# EAGLE design miniprinter x axis (EAGLE 9.4.2)
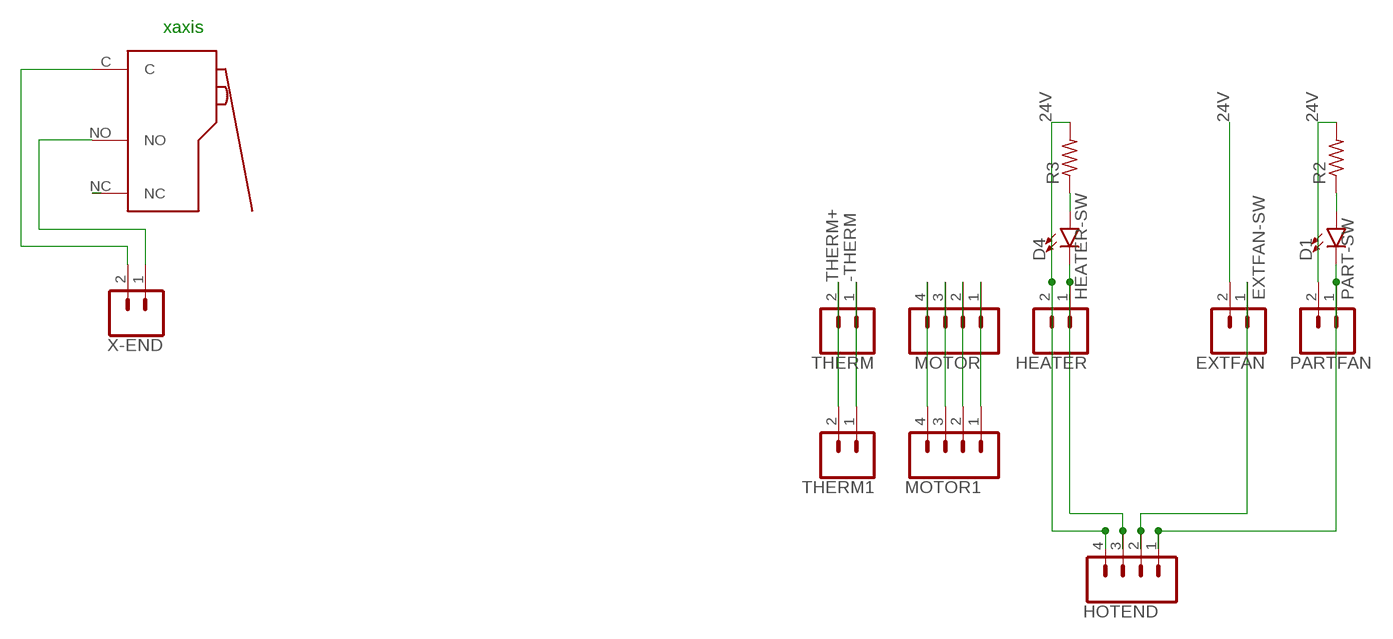
[diagram p0: schematic, sheet 1]

## Parts
D1  LED-FKIT-1206  [FKIT-LED-1206]
D4  LED-FKIT-1206  [FKIT-LED-1206]
EXTFAN  CONN_023.5MM_LOCK  [SCREWTERMINAL-3.5MM-2_LOCK]
HEATER  CONN_023.5MM_LOCK  [SCREWTERMINAL-3.5MM-2_LOCK]
HOTEND  CONN_04SCREW_LOCK  [SCREWTERMINAL-3.5MM-4_LOCK]
MOTOR  CONN_04SCREW_LOCK  [SCREWTERMINAL-3.5MM-4_LOCK]
MOTOR1  CONN_04SCREW_LOCK  [SCREWTERMINAL-3.5MM-4_LOCK]
PARTFAN  CONN_023.5MM_LOCK  [SCREWTERMINAL-3.5MM-2_LOCK]
R2  R-US_R1206  [R1206]
R3  R-US_R1206  [R1206]
THERM  CONN_023.5MM_LOCK  [SCREWTERMINAL-3.5MM-2_LOCK]
THERM1  CONN_023.5MM_LOCK  [SCREWTERMINAL-3.5MM-2_LOCK]
U$2  Lever Microswitch Leftangle PCB mount, with Roller style lever, with a red roller  LEVERMICROPCBLEFTANGLE  [LEVERMICROPCB-LEFTANGLE]
X-END  CONN_023.5MM_LOCK  [SCREWTERMINAL-3.5MM-2_LOCK]

## Nets
24V: EXTFAN.2 HEATER.2 HOTEND.4 PARTFAN.2 R2.2 R3.2
-THERM: THERM1.1 THERM.1
EXTFAN-SW: EXTFAN.1 HOTEND.2
HEATER-SW: D4.C HEATER.1 HOTEND.3
N$1: U$2.NC
N$48: D1.A R2.1
N$49: D4.A R3.1
N$50: MOTOR1.4 MOTOR.4
N$51: MOTOR1.3 MOTOR.3
N$52: MOTOR1.2 MOTOR.2
N$53: MOTOR1.1 MOTOR.1
N$54: U$2.NO X-END.1
N$55: U$2.C X-END.2
PART-SW: D1.C HOTEND.1 PARTFAN.1
THERM+: THERM1.2 THERM.2

## Notes on the sheet
- xaxis

## Library data of the parts
D1 D4 = SparkFun-LED:LED: LED (Generic) Standard schematic elements and footprints for 5mm, 3mm, 1206, and 0603 sized LEDs. Generic LEDs with no color specified.
EXTFAN HEATER PARTFAN THERM THERM1 X-END = SparkFun-Connectors:CONN_02: Multi connection point. Often used as Generic Header-pin footprint for 0.1 inch spaced/style header connections On any of the 0.1 inch spaced packages, you can populate with these: Break Away Headers - Straight <https://www.sparkfun.com/products/116> (PRT-00116) Break Away Male Headers - Right Angle <https://www.sparkfun.com/products/553> (PRT-00553) Female Headers <https://www.sparkfun.com/products/115> (PRT-00115) Break Away Headers - Machine Pin <https://www.sparkfun.com/products/117> (PRT-00117) Break Away Female Headers - Swiss Machine Pin <https://www.sparkfun.com/products/743> (PRT-00743) For SCREWTERMINALS and SPRING TERMINALS visit here: Screw Terimnals on SparkFun.com <https://www.sparkfun.com/search/results?term=Screw+Terminals> (5mm/3.5mm/2.54mm spacing) This device is also useful as a general connection point to wire up your design to another part of your project. Our various solder wires solder well into these plated through hole pads. Hook-Up Wire - Assortment (Stranded, 22 AWG) <https://www.sparkfun.com/products/11375> (PRT-11375) Hook-Up Wire - Assortment (Solid Core, 22 AWG) <https://www.sparkfun.com/products/11367> (PRT-11367) View the entire wire category on our website here <https://www.sparkfun.com/categories/141> Special notes: Molex polarized connector foot print use with: PRT-08233 with associated crimp pins and housings. 2.54_SCREWTERM for use with PRT-10571. 3.5mm Screw Terminal footprints for PRT-08084 5mm Screw Terminal footprints for use with PRT-08432; PROD_ID: CONN-08399
HOTEND MOTOR MOTOR1 = SparkFun-Connectors:CONN_04: Multi connection point. Often used as Generic Header-pin footprint for 0.1 inch spaced/style header connections On any of the 0.1 inch spaced packages, you can populate with these: Break Away Headers - Straight <https://www.sparkfun.com/products/116> (PRT-00116) Break Away Male Headers - Right Angle <https://www.sparkfun.com/products/553> (PRT-00553) Female Headers <https://www.sparkfun.com/products/115> (PRT-00115) Break Away Headers - Machine Pin <https://www.sparkfun.com/products/117> (PRT-00117) Break Away Female Headers - Swiss Machine Pin <https://www.sparkfun.com/products/743> (PRT-00743) For SCREWTERMINALS and SPRING TERMINALS visit here: Screw Terimnals on SparkFun.com <https://www.sparkfun.com/search/results?term=Screw+Terminals> (5mm/3.5mm/2.54mm spacing) This device is also useful as a general connection point to wire up your design to another part of your project. Our various solder wires solder well into these plated through hole pads. Hook-Up Wire - Assortment (Stranded, 22 AWG) <https://www.sparkfun.com/products/11375> (PRT-11375) Hook-Up Wire - Assortment (Solid Core, 22 AWG) <https://www.sparkfun.com/products/11367> (PRT-11367) View the entire wire category on our website here <https://www.sparkfun.com/categories/141> Special notes: Molex polarized connector foot print use with SKU : PRT-08231 with associated crimp pins and housings. 1MM SMD Version SKU: PRT-10208
R2 R3 = rcl:R-US_: RESISTOR, American symbol; SPICEPREFIX: R
U$2 = Lever Microswitch Right Angle:LEVERMICROPCB

## Net classes
0 default: width 0.203 mm, clearance 0.152 mm

## Board
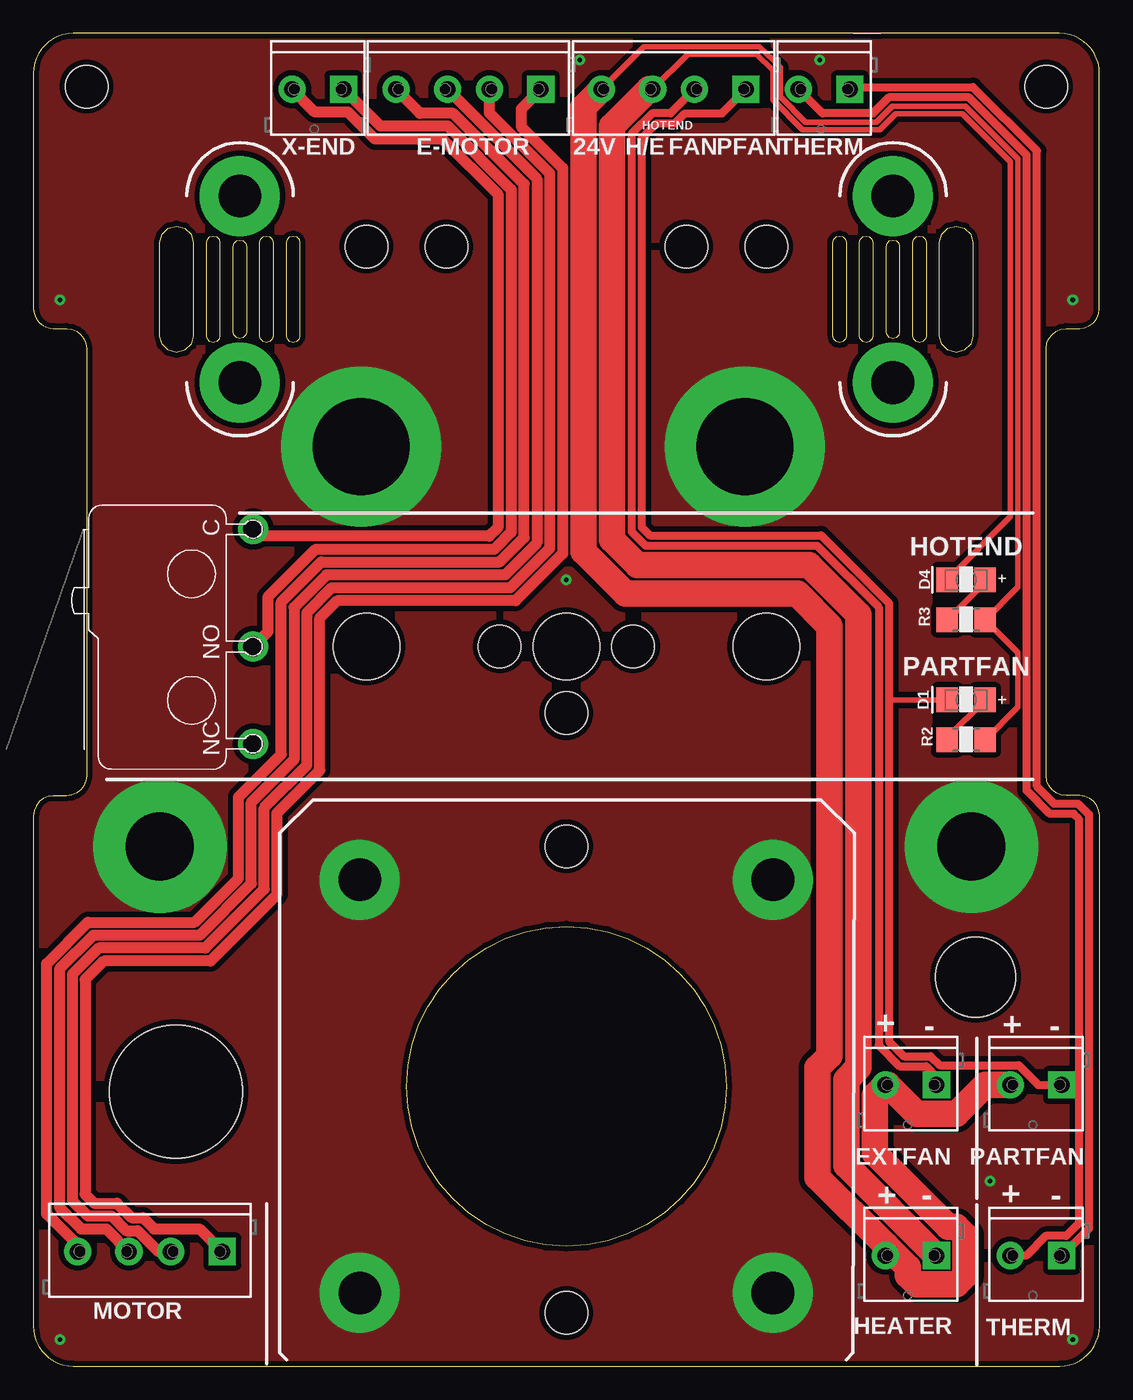
[diagram p1: board, top side]
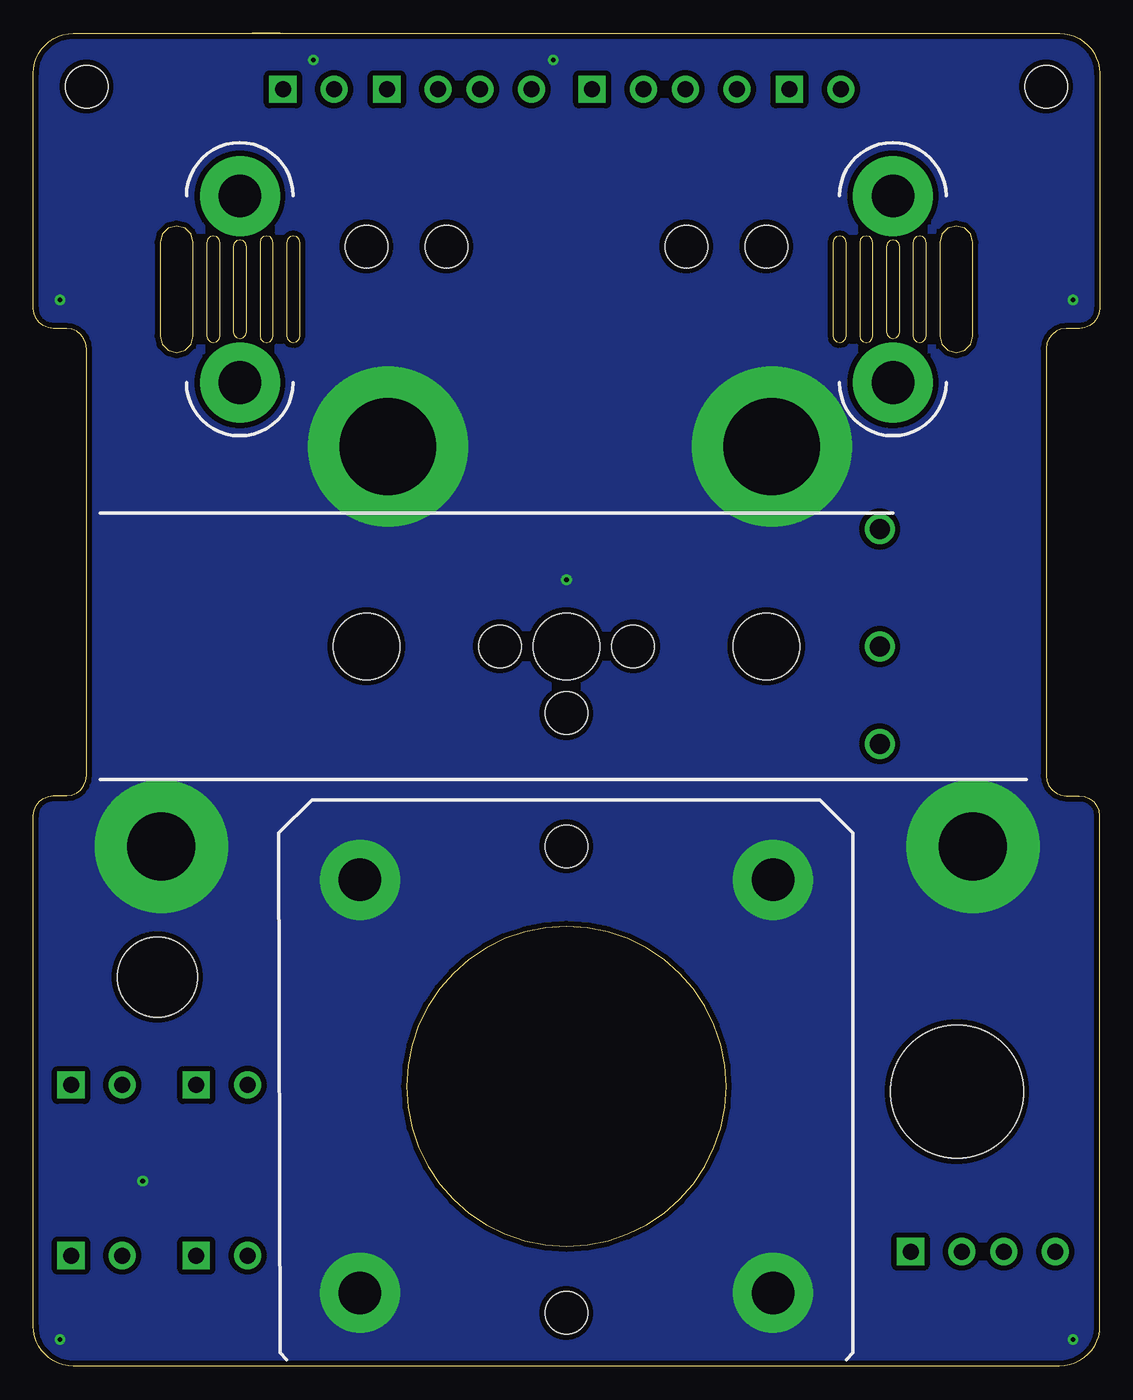
[diagram p2: board, bottom side, seen from below]

Size 80 x 100 mm. Coordinates in mm from the lower left corner, seen from the top.
Outline: 77,100 61.5,100 63.6,100 3,100 2.61,99.97 2.22,99.9 1.85,99.77 1.5,99.6 1.17,99.38 0.88,99.12 0.62,98.83 0.4,98.5 0.23,98.15 0.1,97.78 0.03,97.39 0,97 0,79.35 0.05,78.96 0.2,78.6 0.44,78.29 0.75,78.05 1.11,77.9 1.5,77.85 2.5,77.85 2.89,77.8 3.25,77.65 3.56,77.41 3.8,77.1 3.95,76.74 4,76.35 4,44.3 3.95,43.91 3.8,43.55 3.56,43.24 3.25,43 2.89,42.85 2.5,42.8 1.5,42.8 1.11,42.75 0.75,42.6 0.44,42.36 0.2,42.05 0.05,41.69 0,41.3 0,3 0.03,2.61 0.1,2.22 0.23,1.85 0.4,1.5 0.62,1.17 0.88,0.88 1.17,0.62 1.5,0.4 1.85,0.23 2.22,0.1 2.61,0.03 3,0 77,0 77.39,0.03 77.78,0.1 78.15,0.23 78.5,0.4 78.83,0.62 79.12,0.88 79.38,1.17 79.6,1.5 79.77,1.85 79.9,2.22 79.97,2.61 80,3 80,41.3 79.95,41.69 79.8,42.05 79.56,42.36 79.25,42.6 78.89,42.75 78.5,42.8 77.5,42.8 77.11,42.85 76.75,43 76.44,43.24 76.2,43.55 76.05,43.91 76,44.3 76,76.35 76.05,76.74 76.2,77.1 76.44,77.41 76.75,77.65 77.11,77.8 77.5,77.85 78.5,77.85 78.89,77.9 79.25,78.05 79.56,78.29 79.8,78.6 79.95,78.96 80,79.35 80,97 79.97,97.39 79.9,97.78 79.77,98.15 79.6,98.5 79.38,98.83 79.12,99.12 78.83,99.38 78.5,99.6 78.15,99.77 77.78,99.9 77.39,99.97 77,100
Outline: 48.49,29.49 49.52,28.31 50.39,27 51.09,25.59 51.59,24.11 51.9,22.57 52,21 51.9,19.43 51.59,17.89 51.09,16.41 50.39,15 49.52,13.69 48.49,12.51 47.31,11.48 46,10.61 44.59,9.91 43.11,9.41 41.57,9.1 40,9 38.43,9.1 36.89,9.41 35.41,9.91 34,10.61 32.7,11.48 31.52,12.51 30.48,13.69 29.61,15 28.91,16.41 28.41,17.89 28.1,19.43 28,21 28.1,22.57 28.41,24.11 28.91,25.59 29.61,27 30.48,28.31 31.52,29.49 32.7,30.52 34,31.39 35.41,32.09 36.89,32.59 38.43,32.9 40,33 41.57,32.9 43.11,32.59 44.59,32.09 46,31.39 47.31,30.52 48.49,29.49
Outline: 13.07,77.05 13,77.3 13,84.3 13.07,84.55 13.25,84.73 13.5,84.8 13.75,84.73 13.93,84.55 14,84.3 14,77.3 13.93,77.05 13.75,76.87 13.5,76.8 13.25,76.87 13.07,77.05
Outline: 66.75,76.87 66.5,76.8 66.25,76.87 66.07,77.05 66,77.3 66,84.3 66.07,84.55 66.25,84.73 66.5,84.8 66.75,84.73 66.93,84.55 67,84.3 67,77.3 66.93,77.05 66.75,76.87
Outline: 64,77.6 64,84 64.07,84.25 64.25,84.43 64.5,84.5 64.75,84.43 64.93,84.25 65,84 65,77.6 64.93,77.35 64.75,77.17 64.5,77.1 64.25,77.17 64.07,77.35 64,77.6
Outline: 68.63,85.38 69.25,85.55 69.88,85.38 70.33,84.93 70.5,84.3 70.5,77.3 70.33,76.68 69.88,76.22 69.25,76.05 68.63,76.22 68.17,76.68 68,77.3 68,84.3 68.17,84.93 68.63,85.38
Outline: 10.13,85.38 10.75,85.55 11.38,85.38 11.83,84.93 12,84.3 12,77.3 11.83,76.68 11.38,76.22 10.75,76.05 10.13,76.22 9.67,76.68 9.5,77.3 9.5,84.3 9.67,84.93 10.13,85.38
Outline: 17,84.3 17.07,84.55 17.25,84.73 17.5,84.8 17.75,84.73 17.93,84.55 18,84.3 18,77.3 17.93,77.05 17.75,76.87 17.5,76.8 17.25,76.87 17.07,77.05 17,77.3 17,84.3
Outline: 15.5,84.5 15.75,84.43 15.93,84.25 16,84 16,77.6 15.93,77.35 15.75,77.17 15.5,77.1 15.25,77.17 15.07,77.35 15,77.6 15,84 15.07,84.25 15.25,84.43 15.5,84.5
Outline: 60,84.3 60.07,84.55 60.25,84.73 60.5,84.8 60.75,84.73 60.93,84.55 61,84.3 61,77.3 60.93,77.05 60.75,76.87 60.5,76.8 60.25,76.87 60.07,77.05 60,77.3 60,84.3
Outline: 19.75,84.73 19.93,84.55 20,84.3 20,77.3 19.93,77.05 19.75,76.87 19.5,76.8 19.25,76.87 19.07,77.05 19,77.3 19,84.3 19.07,84.55 19.25,84.73 19.5,84.8 19.75,84.73
Outline: 62.75,84.73 62.93,84.55 63,84.3 63,77.3 62.93,77.05 62.75,76.87 62.5,76.8 62.25,76.87 62.07,77.05 62,77.3 62,84.3 62.07,84.55 62.25,84.73 62.5,84.8 62.75,84.73
Copper layers (1*16): Top 0.035mm / dielectric 1.5mm / Bottom 0.035mm
Design rules "default *": minimum track width 6mil, minimum drill 0.35mm, track to track 6mil, track to pad 6mil, pad to pad 6mil, via to via 6mil, smd to smd 6mil, copper to edge 10mil, drill to drill 6mil, minimum pad ring 10mil, minimum via ring 8mil, stop-mask expansion 4mil, vias tented up to drill 0mil, thermal gap 10mil
Holes 6 mm at 70.7,29.2
Holes 10 mm at 10.7,20.6
Holes 5 mm at 40,54 55,54 25,54
Holes 3.2 mm at 40,49 40,39 40,4 45,54 35,54 25,84 55,84 76,96 4,96 49,84 31,84

### Footprints (pad centres in the part's own frame; a part is rotated, then mirrored left to right if it is on the bottom)
FKIT-LED-1206 = smd 1.6 x 1.803: A -1.422,0; C 1.422,0
SCREWTERMINAL-3.5MM-2_LOCK = drill 1.2 pad 2.032 square: 1 -0.178,0 | drill 1.2 pad 2.032: 2 3.678,0
SCREWTERMINAL-3.5MM-4_LOCK = drill 1.2 pad 2.032 square: 1 -0.178,0 | drill 1.2 pad 2.032: 2 3.678,0; 3 6.822,0; 4 10.678,0
R1206 = smd 1.6 x 1.803: 1 -1.422,0; 2 1.422,0
LEVERMICROPCB-LEFTANGLE = drill 1.5: C 7.3,-7.1; NC -8.8,-7.1; NO -1.5,-7.1

### Placement (x,y rotation side)
D1  70,50 180 top
D4  70,59 180 top
EXTFAN  67.6,21.1 180 top
HEATER  67.6,8.3 180 top
HOTEND  53.3,95.8 180 top
MOTOR  14,8.6 180 top
MOTOR1  37.9,95.8 180 top
PARTFAN  77,21.1 180 top
R2  70,47 0 top
R3  70,56 0 top
THERM  77,8.3 180 top
THERM1  61.1,95.8 180 top
U$2  9.4,55.5 90 top
X-END  23.1,95.8 180 top

### Tracks (layer width: path | path; a pad name or v marks a point on that pad's centre or on a via)
24V
  Top 0.406: HOTEND.4 45.82,99 54.5,99 56.05,97.45 56.05,95.23 57.94,93.34 63.27,93.34 64.47,94.54 69.92,94.54 73.87,90.59 73.87,58.46 R3.2 73.87,53.54 73.87,49.46 R2.2
  Top 2: PARTFAN.2 71.44,21.1 69.27,18.93 66.28,18.93 64.11,21.1 EXTFAN.2 63.15,20.33 63.15,15.97 68.65,10.47 69.27,10.47 69.94,9.79 69.94,6.81 69.27,6.13 66.28,6.13 65.61,6.81 65.61,7.42 64.01,9.02 63.92,8.92 HEATER.2 63.92,9.11 58.84,14.19 58.84,22.39 59.75,23.3 59.75,55.52 57.32,57.95 44.44,57.95 41.28,61.12 41.28,94.46 HOTEND.4
-THERM
  Top 0.61: THERM.1 79.2,10.32 79.2,41.4 78.4,42.2 76.6,42.2 75.3,43.5 75.3,91.18 70.51,95.96 61.44,95.96 THERM1.1
EXTFAN-SW
  Top 0.61: 49.62,95.72 HOTEND.2 47.82,94 46.45,94 44.9,92.45 44.9,62.61 45.94,61.56 58.81,61.56 63.43,56.94 63.43,24.06 65,22.5 67,22.5 67.77,21.72 EXTFAN.1
HEATER-SW
  Top 0.406: D4.C 73.31,63.74 73.31,90.36 69.69,93.98 64.7,93.98 63.5,92.78 57.71,92.78 55.49,95 55.49,97.22 54.26,98.44 49.12,98.44 HOTEND.3
  Top 2: HEATER.1 61,15.08 61,21.5 61.9,22.4 61.9,56.41 58.21,60.11 45.34,60.11 43.43,62.01 43.43,93.05 46.18,95.8 HOTEND.3
N$43  (via drill 3.2 pad 6)
  other vias: 64.5,73.8
N$44  (via drill 3.2 pad 6)
  other vias: 64.5,87.8
N$45  (via drill 3.2 pad 6)
  other vias: 15.5,87.8
N$46  (via drill 3.2 pad 6)
  other vias: 15.5,73.8
N$48
  Top 0.406: R2.1 68.57,47.16 D1.A
N$49
  Top 0.406: R3.1 71.42,58.84 D4.A
N$50
  Top 0.813: MOTOR1.4 29.02,94 31.51,94 36.83,88.68 36.83,62.17 35,60.33 21.6,60.33 18.6,57.33 18.6,45.9 15.4,42.7 15.4,36.6 12.1,33.3 4.1,33.3 1,30.2 1,11.42 3.32,9.1 MOTOR.4
N$51
  Top 0.813: MOTOR.3 5.47,10.3 3.58,10.3 1.96,11.92 1.96,29.8 4.5,32.33 12.5,32.33 16.36,36.2 16.36,42.3 19.56,45.5 19.56,56.94 22,59.37 35.4,59.37 37.79,61.77 37.79,89.08 MOTOR1.3
N$52
  Top 0.813: MOTOR.2 9.4,8.6 7.83,10.18 6.96,10.18 5.87,11.26 4.08,11.26 2.93,12.42 2.93,29.4 4.9,31.37 12.9,31.37 17.33,35.8 17.33,41.9 20.53,45.1 20.53,56.54 22.4,58.4 35.8,58.4 38.76,61.37 38.76,89.48 34.22,94.02 MOTOR1.2
N$53
  Top 0.813: MOTOR.1 12.47,10.3 9.07,10.3 8.23,11.14 7.36,11.14 6.27,12.23 4.57,12.23 3.89,12.9 3.89,29 5.3,30.4 13.3,30.4 18.29,35.4 18.29,41.5 21.49,44.7 21.49,56.14 22.8,57.44 36.2,57.44 39.72,60.97 39.72,89.88 36.6,93.01 36.6,94.32 MOTOR1.1
N$54
  Top 0.813: X-END.1 26.04,93.04 31.11,93.04 35.86,88.28 35.86,62.56 34.6,61.3 21.2,61.3 17.6,57.7 17.6,55.1 U$2.NO
N$55
  Top 0.813: X-END.2 21.12,94.1 23.61,94.1 25.64,92.07 30.71,92.07 34.9,87.88 34.9,62.96 34.2,62.26 17.03,62.26 U$2.C
PART-SW
  Top 0.406: D1.C 64.2,50
  Top 0.61: 53.47,95.78 HOTEND.1 51.67,94 48.9,94 48.13,93.24 46.76,93.24 45.66,92.13 45.66,62.92 46.25,62.32 59.13,62.32 64.2,57.25 64.2,50 64.2,24.38 65.31,23.26 67.31,23.26 68,22.57 73.93,22.57 75.4,21.1 PARTFAN.1
THERM+
  Top 0.61: THERM.2 74.5,8.3 75.97,9.77 77.5,9.77 78.43,10.71 78.43,41.08 78.08,41.44 76.28,41.44 74.53,43.18 74.53,90.86 70.2,95.2 64.2,95.2 63,94 59.22,94 THERM1.2
XCARGND  (via drill 0.35 pad 0.8, 3.2 pad 6, 5.1 pad 10, 7.25 pad 12)
  other vias: 24.6,69 53.4,69 9.5,39 70.4,39 24.5,36.5 55.5,36.5 55.5,5.5 24.5,5.5 78,80 71.8,13.9 40,59 59,98 41,98 2,80 2,2 78,2
  pour Top (isolate 0.406): 0,3 arc81 3,0 77,0 arc81 80,3 80,42 79,43 77,43 76,44 76,77 77,78 79,78 80,79 80,97 arc81 77,100 3,100 arc81 0,97 0,79 1,78 3,78 4,77 4,44 3,43 1,43 0,42
  pour Bottom (isolate 0.406): 0,3 arc81 3,0 77,0 arc81 80,3 80,42 79,43 77,43 76,44 76,77 77,78 79,78 80,79 80,97 arc81 77,100 3,100 arc81 0,97 0,79 1,78 3,78 4,77 4,44 3,43 1,43 0,42

### Text on the board
tPlace: X-END | E-MOTOR | 24V | H/E | FAN | PFAN | THERM | HOTEND | + | PARTFAN | + | + | - | + | - | + | - | + | -